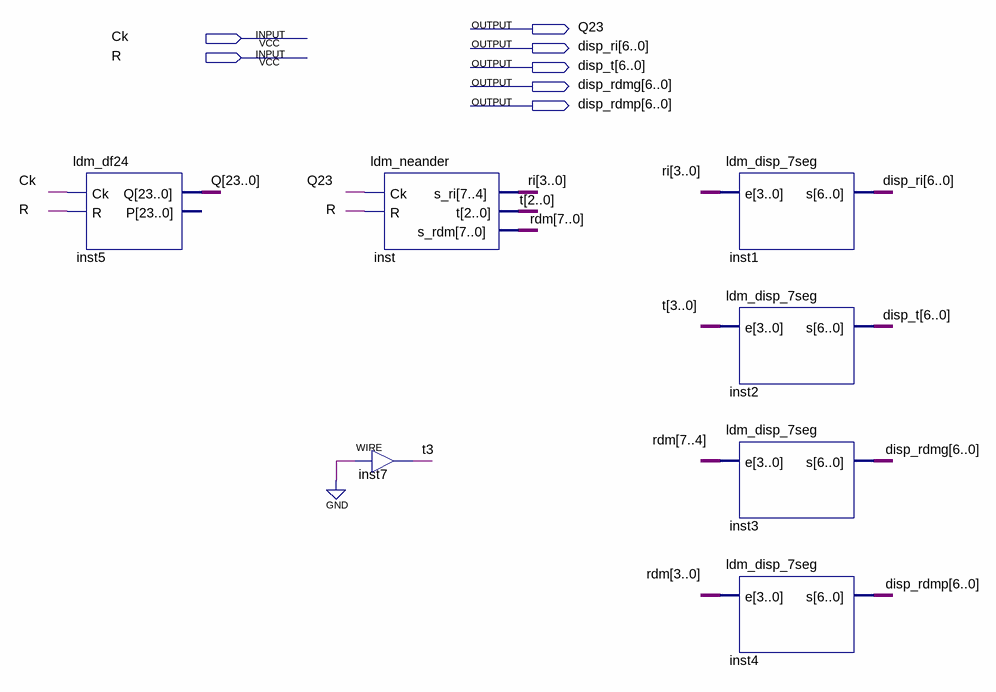
[diagram p0: schematic sheet]
// Quartus schematic ldm_neander_placa.bdf as structural Verilog: 7 symbols, 7 pins
module ldm_neander_placa (
  input  Ck,
  input  R,
  output Q23,
  output [6:0] disp_ri,
  output [6:0] disp_t,
  output [6:0] disp_rdmg,
  output [6:0] disp_rdmp
);

  wire [3:0] ri, t;
  wire [7:0] rdm;
  wire [22:0] Q;

  ldm_df24 inst5 (.Ck(Ck), .R(R), .Q({Q23, Q}));  // open: P
  ldm_neander inst (.Ck(Q23), .R(R), .s_ri(ri), .t(t[2:0]), .s_rdm(rdm));
  assign t[3] = 1'b0;  // WIRE inst7
  ldm_disp_7seg inst1 (.e(ri), .s(disp_ri));
  ldm_disp_7seg inst2 (.e(t), .s(disp_t));
  ldm_disp_7seg inst3 (.e(rdm[7:4]), .s(disp_rdmg));
  ldm_disp_7seg inst4 (.e(rdm[3:0]), .s(disp_rdmp));
endmodule
